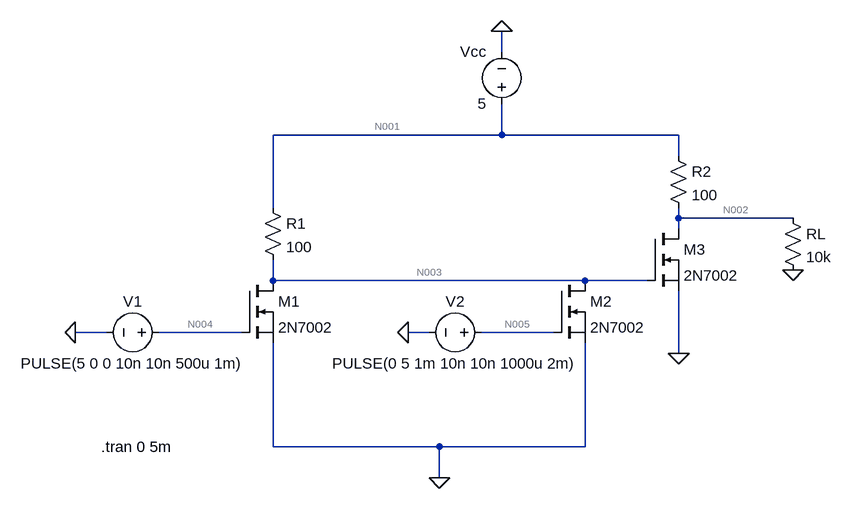
[diagram p0: schematic MOS_OR.asc]
MOS_OR.asc, the LTspice schematic file:
Version 4
SHEET 1 880 680
WIRE 272 -336 272 -368
WIRE 272 -208 272 -256
WIRE 272 -208 -80 -208
WIRE 544 -208 272 -208
WIRE 544 -176 544 -208
WIRE -80 -96 -80 -208
WIRE 544 -80 544 -96
WIRE 720 -80 544 -80
WIRE 544 -64 544 -80
WIRE -80 16 -80 -16
WIRE 400 16 -80 16
WIRE 496 16 400 16
WIRE -336 96 -384 96
WIRE -128 96 -256 96
WIRE 160 96 128 96
WIRE 352 96 240 96
WIRE 544 128 544 32
WIRE -80 272 -80 112
WIRE 176 272 -80 272
WIRE 400 272 400 112
WIRE 400 272 176 272
WIRE 176 320 176 272
FLAG 176 320 0
FLAG -384 96 0
FLAG 272 -368 0
FLAG 128 96 0
FLAG 544 128 0
FLAG 720 0 0
SYMBOL voltage 272 -240 R180
WINDOW 0 24 96 Left 2
WINDOW 3 24 16 Left 2
WINDOW 123 0 0 Left 0
WINDOW 39 24 68 Left 2
SYMATTR InstName Vcc
SYMATTR Value 5
SYMBOL voltage -240 96 R90
WINDOW 0 -32 56 VBottom 2
WINDOW 3 32 56 VTop 2
WINDOW 123 0 0 Left 0
WINDOW 39 0 0 Left 0
SYMATTR InstName V1
SYMATTR Value PULSE(5 0 0 10n 10n 500u 1m)
SYMBOL res -96 -112 R0
SYMATTR InstName R1
SYMATTR Value 100
SYMBOL nmos -128 16 R0
SYMATTR InstName M1
SYMATTR Value 2N7002
SYMBOL res 528 -192 R0
SYMATTR InstName R2
SYMATTR Value 100
SYMBOL nmos 352 16 R0
SYMATTR InstName M2
SYMATTR Value 2N7002
SYMBOL nmos 496 -64 R0
SYMATTR InstName M3
SYMATTR Value 2N7002
SYMBOL voltage 256 96 R90
WINDOW 0 -32 56 VBottom 2
WINDOW 3 32 56 VTop 2
SYMATTR InstName V2
SYMATTR Value PULSE(0 5 1m 10n 10n 1000u 2m)
SYMBOL res 704 -96 R0
SYMATTR InstName RL
SYMATTR Value 10k
TEXT -344 272 Left 2 !.tran 0 5m

The netlist it stands for:
* MOS_OR.asc
Vcc N001 0 5
V1 N004 0 PULSE(5 0 0 10n 10n 500u 1m)
R1 N001 N003 100
M1 N003 N004 0 0 2N7002
R2 N001 N002 100
M2 N003 N005 0 0 2N7002
M3 N002 N003 0 0 2N7002
V2 N005 0 PULSE(0 5 1m 10n 10n 1000u 2m)
RL N002 0 10k
.model NMOS NMOS
.model PMOS PMOS
.lib standard.mos
.tran 0 5m
.backanno
.end

* Results of the author's LTspice run, read from the files saved beside the schematic
* Operating Point, zero values left out:
*   V(n001) = 5 V
*   V(n004) = 5 V
*   V(n003) = 106.1 mV
*   V(n002) = 4.95 V
*   Id(M3) = 4.987 pA
*   Is(M3) = -4.987 pA
*   Id(M1) = 48.94 mA
*   Is(M1) = -48.94 mA
*   I(Rl) = 495 µA
*   I(R2) = 495 µA
*   I(R1) = 48.94 mA
*   I(Vcc) = -49.43 mA
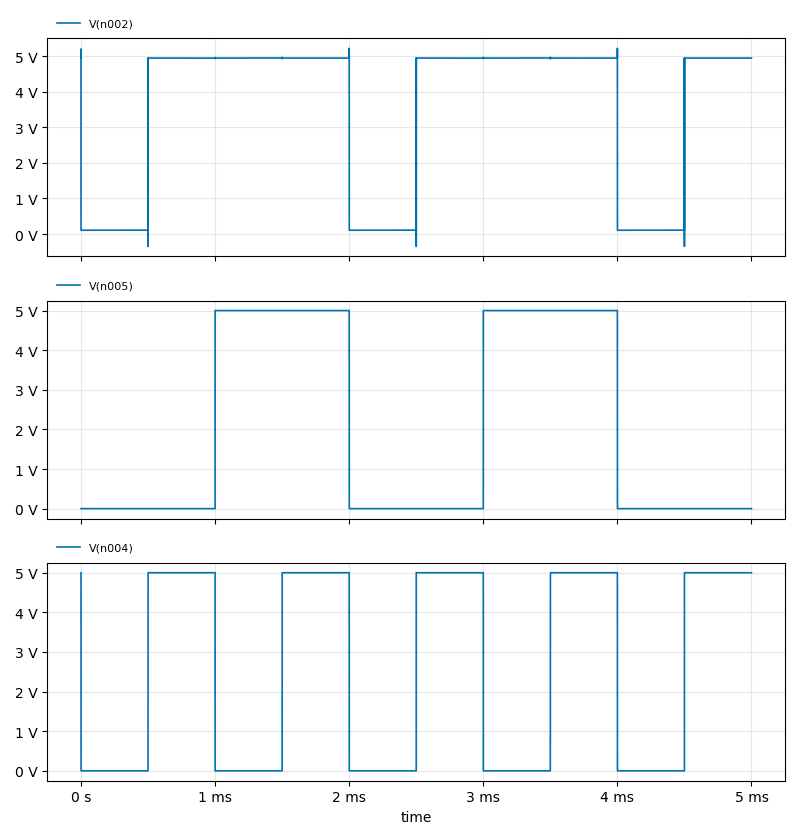
[diagram p1: Transient Analysis of MOS_OR.asc, plotted from the saved traces]
* Transient Analysis, 1 run:
*   V(n002): min -349.5 mV, max 5.224 V, average 3.497 V, rms 4.142 V, last 4.95 V
*   V(n005): min 0 V, max 5 V, average 2 V, rms 3.162 V, last 0 V
*   V(n004): min 0 V, max 5 V, average 2.5 V, rms 3.535 V, last 5 V